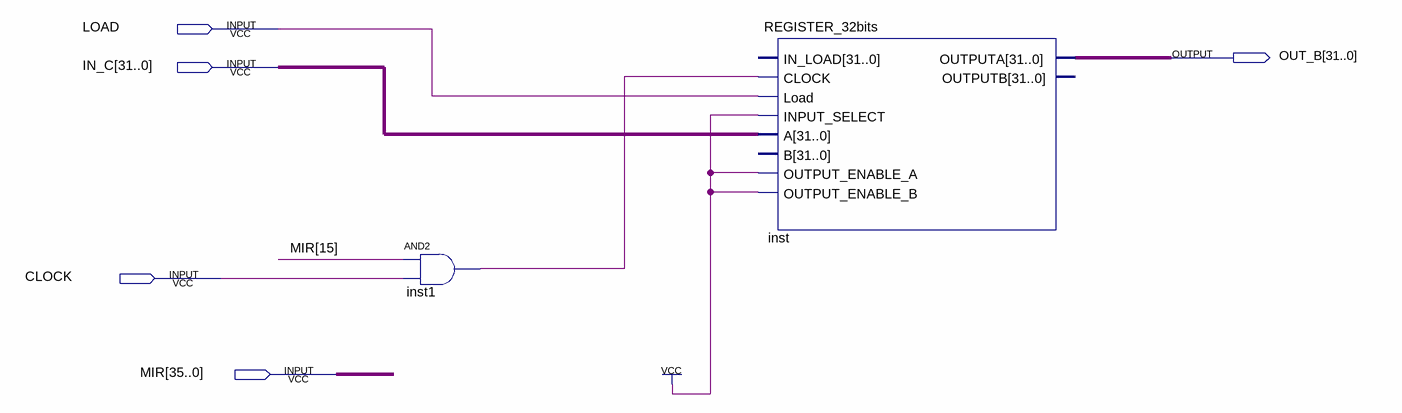
[diagram p0: schematic sheet]
// Quartus schematic H.bdf as structural Verilog: 2 symbols, 5 pins
module H (
  input  LOAD,
  input  [31:0] IN_C,
  input  CLOCK,
  input  [35:0] MIR,
  output [31:0] OUT_B
);

  wire inst1_out;

  and inst1 (inst1_out, MIR[15], CLOCK);
  REGISTER_32bits inst (
    .CLOCK(inst1_out), .Load(LOAD), .INPUT_SELECT(1'b1), .A(IN_C), .OUTPUT_ENABLE_A(1'b1),
    .OUTPUT_ENABLE_B(1'b1), .OUTPUTA(OUT_B));  // open: IN_LOAD, B, OUTPUTB
endmodule
